# Altium schematic sheet Sheet1.SchDoc
size A1; SheetNumber: 1; SheetTotal: 1
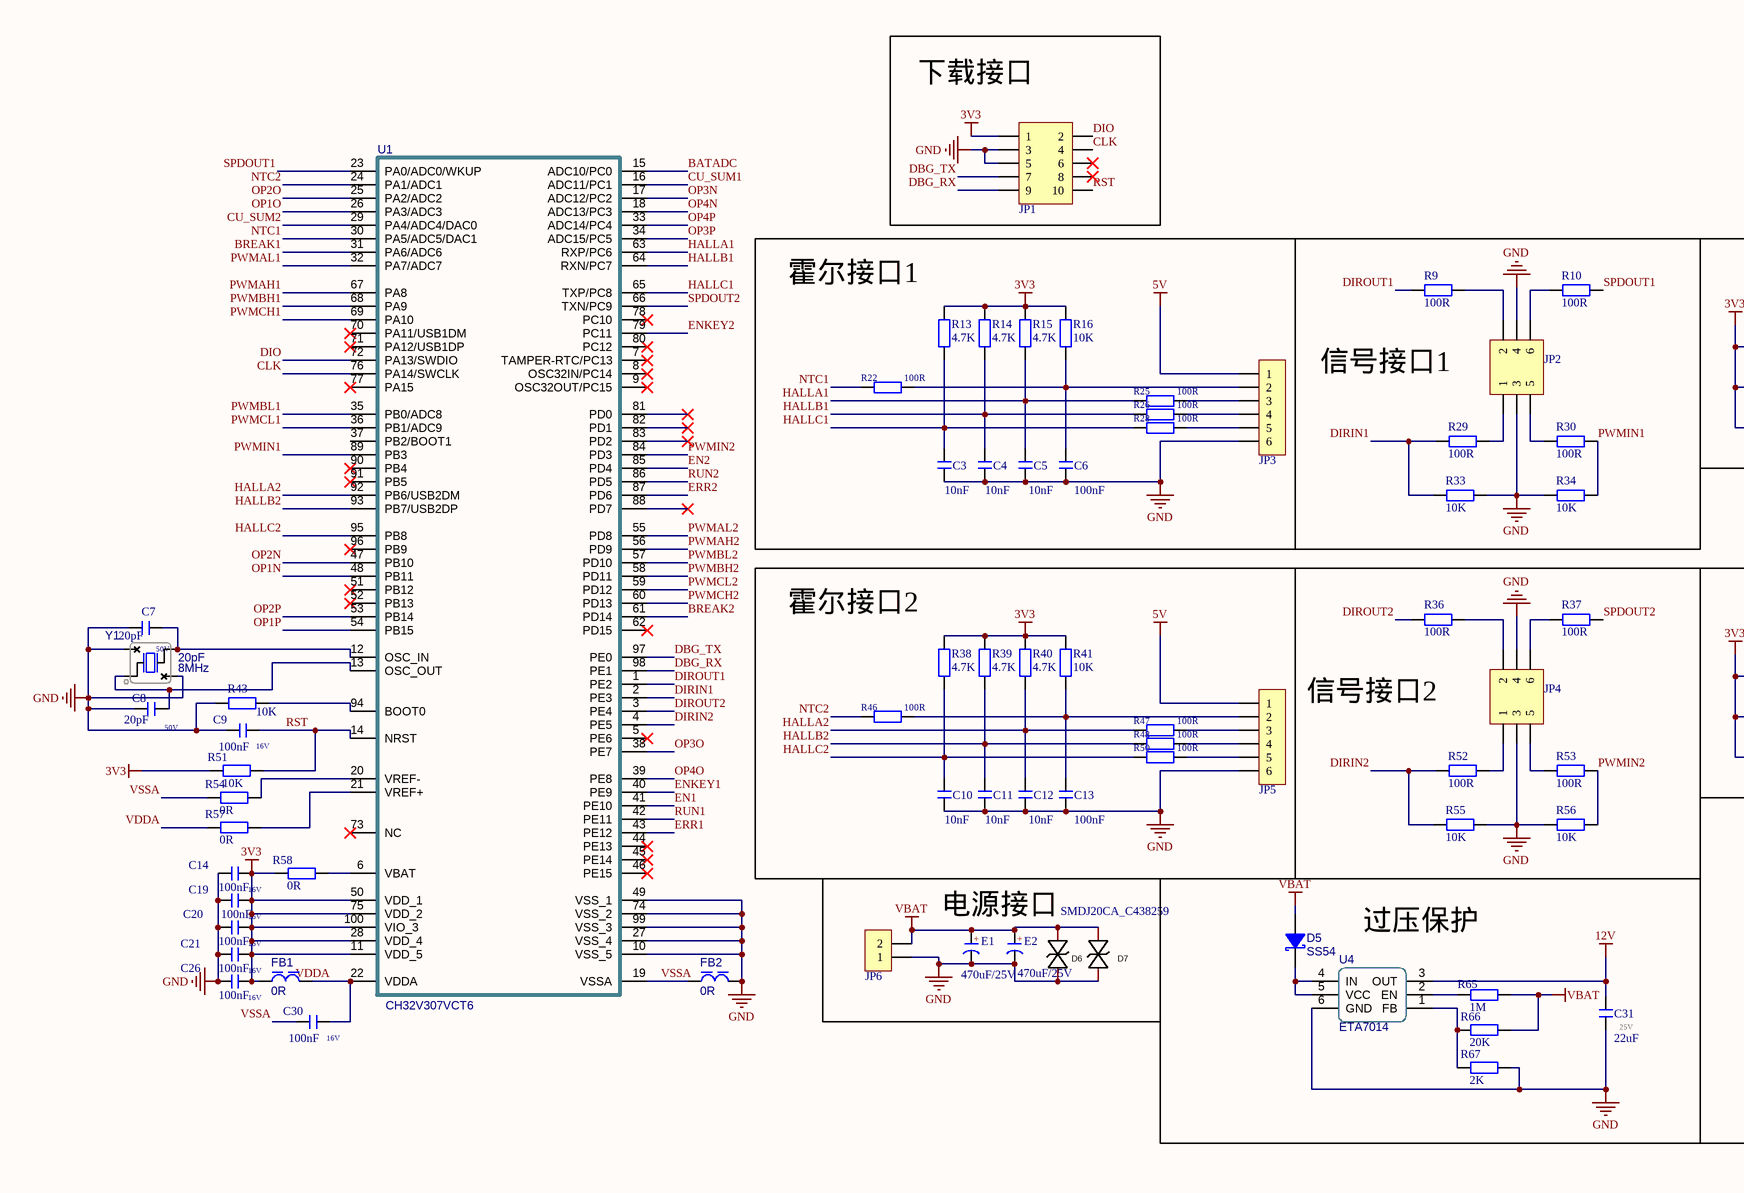
[diagram p0: Sheet1.SchDoc, top left]
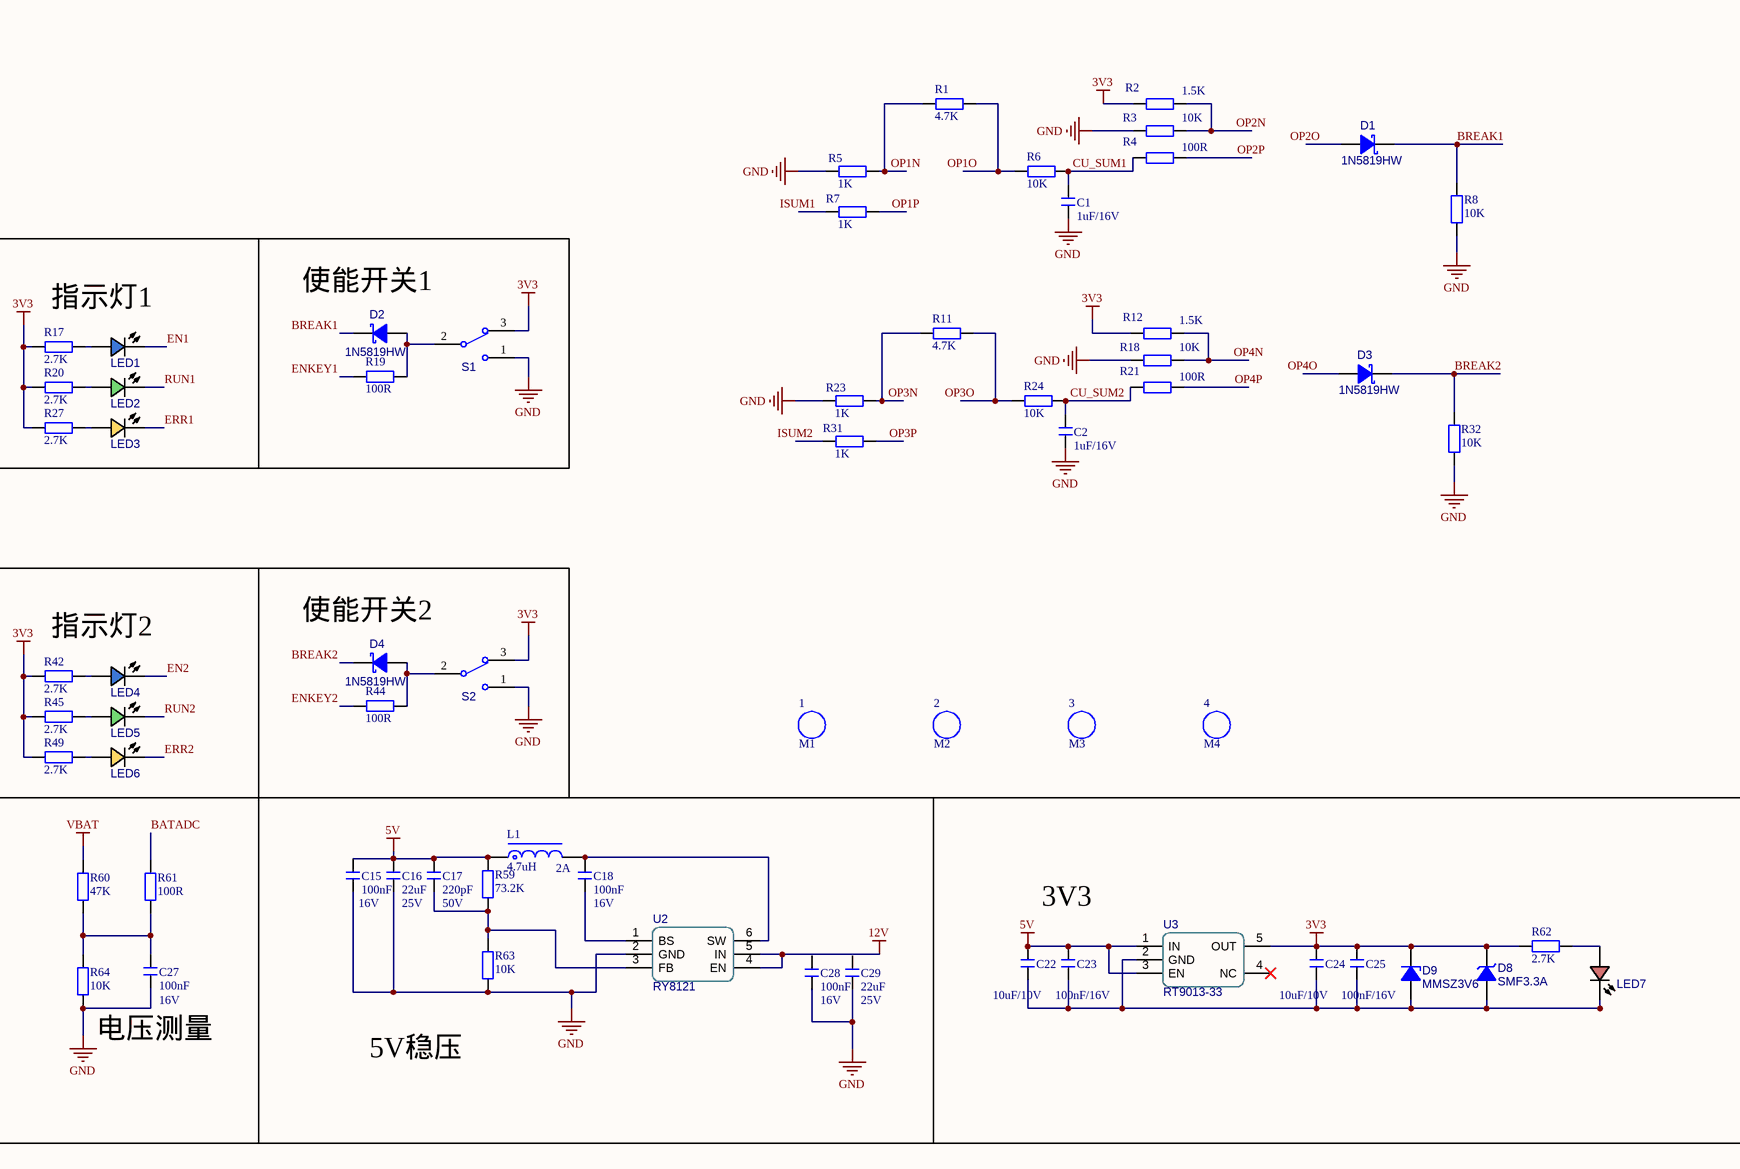
[diagram p1: Sheet1.SchDoc, top right]
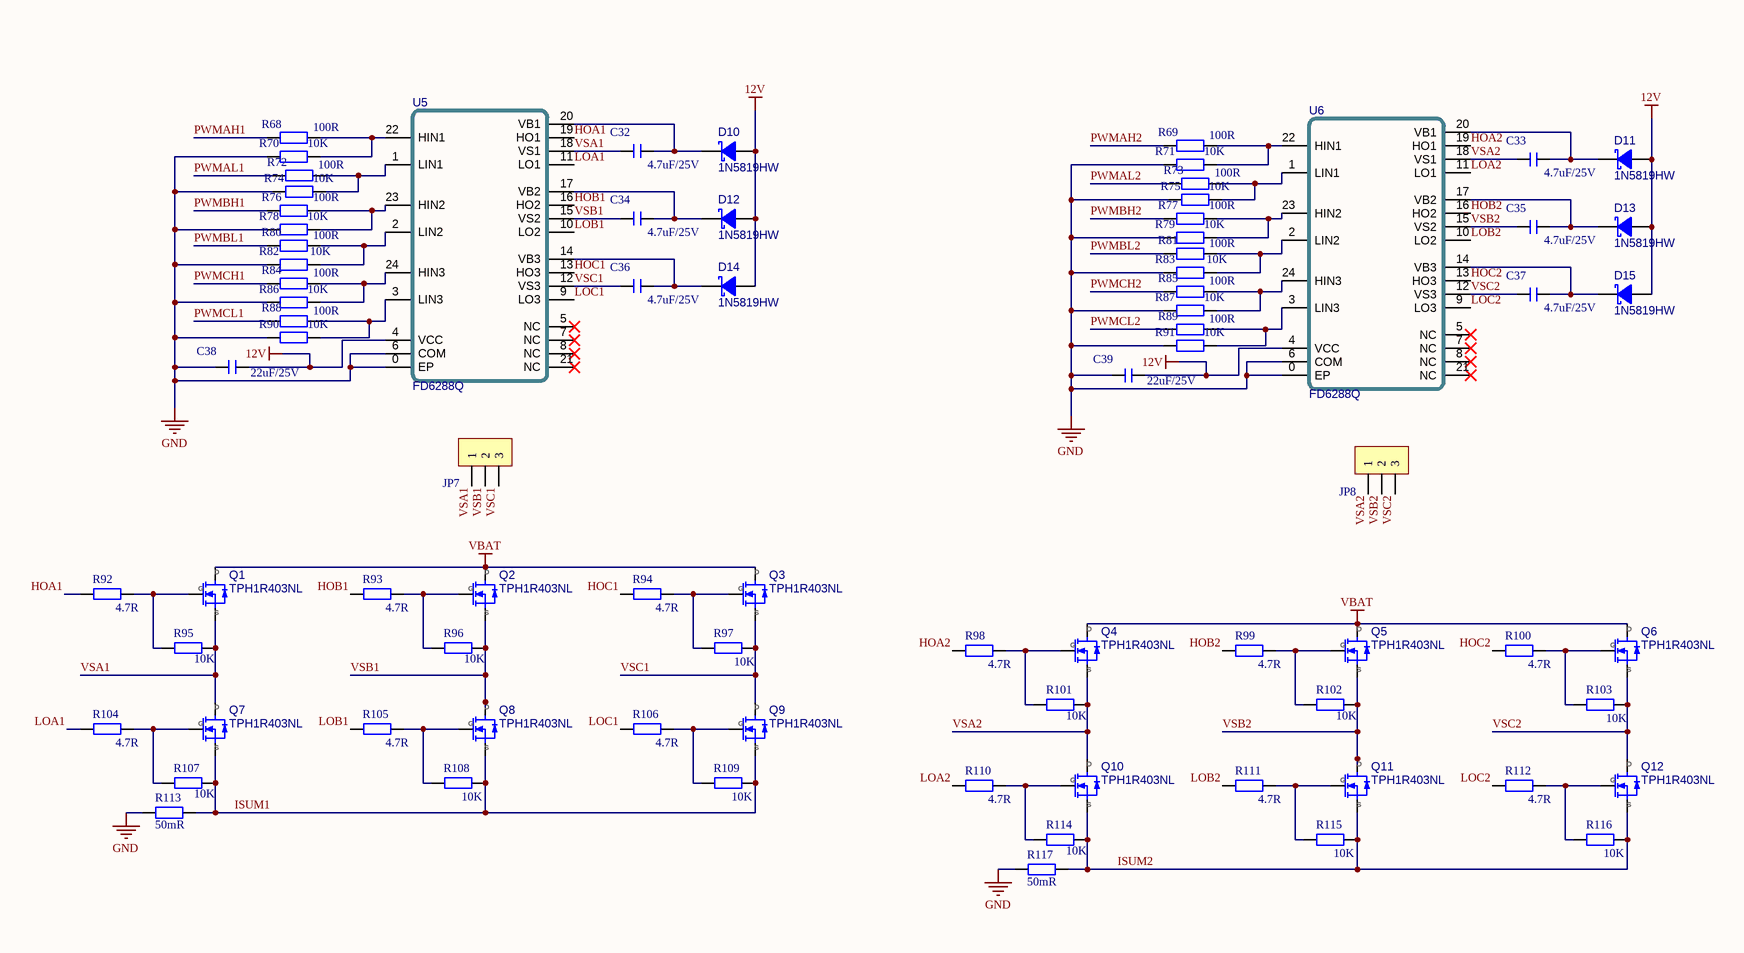
[diagram p2: Sheet1.SchDoc, bottom left]

## Parts
1  M1  [M3 125X200]
2  M2  [M3 125X200]
3  M3  [M3 125X200]
4  M4  [M3 125X200]
C1  1uF/16V  [C 0603_L]
C2  1uF/16V  [C 0603_L]
C3  10nF  [C 0402_L]
C4  10nF  [C 0402_L]
C5  10nF  [C 0402_L]
C6  100nF  [C 0402_L]
C7  20pF  电压: 50V  [C 0402_L]
C8  20pF  电压: 50V  [C 0402_L]
C9  100nF  电压: 16V  [C 0402_L]
C10  10nF  [C 0402_L]
C11  10nF  [C 0402_L]
C12  10nF  [C 0402_L]
C13  100nF  [C 0402_L]
C14  100nF  电压: 16V  [C 0402_L]
C15  100nF  V: 16V  [C 0402_L]
C16  22uF  V: 25V  [C 0805_L]
C17  220pF  V: 50V  [C 0402_L]
C18  100nF  V: 16V  [C 0402_L]
C19  100nF  电压: 16V  [C 0402_L]
C20  100nF  电压: 16V  [C 0402_L]
C21  100nF  电压: 16V  [C 0402_L]
C22  10uF/10V  [C 0603_L]
C23  100nF/16V  [C 0402_L]
C24  10uF/10V  [C 0603_L]
C25  100nF/16V  [C 0402_L]
C26  100nF  电压: 16V  [C 0402_L]
C27  100nF  V: 16V  [C 0402_L]
C28  100nF  V: 16V  [C 0402_L]
C29  22uF  V: 25V  [C 0805_L]
C30  100nF  电压: 16V  [C 0402_M]
C31  22uF  V: 25V  [C 0805_L]
C32  4.7uF/25V  [C 0805_L]
C33  4.7uF/25V  [C 0805_L]
C34  4.7uF/25V  [C 0805_L]
C35  4.7uF/25V  [C 0805_L]
C36  4.7uF/25V  [C 0805_L]
C37  4.7uF/25V  [C 0805_L]
C38  22uF/25V  [C 0805_L]
C39  22uF/25V  [C 0805_L]
D1  1N5819HW  [SOD-123-L]
D2  1N5819HW  [SOD-123-L]
D3  1N5819HW  [SOD-123-L]
D4  1N5819HW  [SOD-123-L]
D5  SS54  [SMA-L[DO-214AC]]
D6  SMDJ20CA_C438259  [SMC_L6.9-W5.9-LS7.9-BI]
D7  SMDJ20CA_C438259  [SMC_L6.9-W5.9-LS7.9-BI]  (value not drawn)
D8  SMF3.3A  [SOD-123-L]
D9  MMSZ3V6  [SOD-123-L]
D10  1N5819HW  [SOD-123-L]
D11  1N5819HW  [SOD-123-L]
D12  1N5819HW  [SOD-123-L]
D13  1N5819HW  [SOD-123-L]
D14  1N5819HW  [SOD-123-L]
D15  1N5819HW  [SOD-123-L]
E1  470uF/25V  [CAP 5.0*10*12.5]
E2  470uF/25V  [CAP 5.0*10*16]
FB1  value 0R  [INDC1005[0402]S]  (hidden comment: 0R @100MHz 500mA)
FB2  value 0R  [INDC1005[0402]S]  (hidden comment: 0R @100MHz 500mA)
JP1  Header 5X2  [HDR2.54-WI-2x5P]  (value not drawn)
JP2  Header3X2  [HDR2.54-LI-2x3P]  (value not drawn)
JP3  HDR-1X6  [ZH1.5-WI-6P]  (value not drawn)
JP4  Header3X2  [HDR2.54-LI-2x3P]  (value not drawn)
JP5  HDR-1X6  [ZH1.5-WI-6P]  (value not drawn)
JP6  HDR-1X2  [KF350-2P]  (value not drawn)
JP7  HDR-1X3  [KF350-3P]  (value not drawn)
JP8  HDR-1X3  [KF350-3P]  (value not drawn)
L1  4.7uH  A: 2A  [CD31]
LED1  蓝色贴片LED  [LEDC1608(0603)-L]  (value not drawn)
LED2  翠绿贴片LED  [LEDC1608(0603)-L]  (value not drawn)
LED3  黄色贴片LED  [LEDC1608(0603)-L]  (value not drawn)
LED4  蓝色贴片LED  [LEDC1608(0603)-L]  (value not drawn)
LED5  翠绿贴片LED  [LEDC1608(0603)-L]  (value not drawn)
LED6  黄色贴片LED  [LEDC1608(0603)-L]  (value not drawn)
LED7  红色贴片LED  [LEDC1608(0603)-L]  (value not drawn)
Q1  TPH1R403NL  [DFN5x6]
Q2  TPH1R403NL  [DFN5x6]
Q3  TPH1R403NL  [DFN5x6]
Q4  TPH1R403NL  [DFN5x6]
Q5  TPH1R403NL  [DFN5x6]
Q6  TPH1R403NL  [DFN5x6]
Q7  TPH1R403NL  [DFN5x6]
Q8  TPH1R403NL  [DFN5x6]
Q9  TPH1R403NL  [DFN5x6]
Q10  TPH1R403NL  [DFN5x6]
Q11  TPH1R403NL  [DFN5x6]
Q12  TPH1R403NL  [DFN5x6]
R1  4.7K  [R 0603_L]
R2  1.5K  [R 0603_L]
R3  10K  [R 0603_L]
R4  100R  [R 0603_L]
R5  1K  [R 0603_L]
R6  10K  [R 0603_L]
R7  1K  [R 0603_L]
R8  10K  [R 0603_L]
R9  100R  [R 0603_L]
R10  100R  [R 0603_L]
R11  4.7K  [R 0603_L]
R12  1.5K  [R 0603_L]
R13  4.7K  [R 0603_L]
R14  4.7K  [R 0603_L]
R15  4.7K  [R 0603_L]
R16  10K  [R 0603_L]
R17  2.7K  [R 0603_L]
R18  10K  [R 0603_L]
R19  100R  [R 0603_L]
R20  2.7K  [R 0603_L]
R21  100R  [R 0603_L]
R22  100R  [R 0603_L]
R23  1K  [R 0603_L]
R24  10K  [R 0603_L]
R25  100R  [R 0603_L]
R26  100R  [R 0603_L]
R27  2.7K  [R 0603_L]
R28  100R  [R 0603_L]
R29  100R  [R 0603_L]
R30  100R  [R 0603_L]
R31  1K  [R 0603_L]
R32  10K  [R 0603_L]
R33  10K  [R 0603_L]
R34  10K  [R 0603_L]
R36  100R  [R 0603_L]
R37  100R  [R 0603_L]
R38  4.7K  [R 0603_L]
R39  4.7K  [R 0603_L]
R40  4.7K  [R 0603_L]
R41  10K  [R 0603_L]
R42  2.7K  [R 0603_L]
R43  10K  [R 0805_L]
R44  100R  [R 0603_L]
R45  2.7K  [R 0603_L]
R46  100R  [R 0603_L]
R47  100R  [R 0603_L]
R48  100R  [R 0603_L]
R49  2.7K  [R 0603_L]
R50  100R  [R 0603_L]
R51  10K  [R 0603_L]
R52  100R  [R 0603_L]
R53  100R  [R 0603_L]
R54  0R  [R 0603_L]
R55  10K  [R 0603_L]
R56  10K  [R 0603_L]
R57  0R  [R 0603_L]
R58  0R  [R 0402_L]
R59  73.2K  [R 0603_L]
R60  47K  [R 0603_L]
R61  100R  [R 0603_L]
R62  2.7K  [R 0603_L]
R63  10K  [R 0603_L]
R64  10K  [R 0603_L]
R65  1M  [R 0603_L]
R66  20K  [R 0603_L]
R67  2K  [R 0603_L]
R68  100R  [R 0603_L]
R69  100R  [R 0603_L]
R70  10K  [R 0603_L]
R71  10K  [R 0603_L]
R72  100R  [R 0603_L]
R73  100R  [R 0603_L]
R74  10K  [R 0603_L]
R75  10K  [R 0603_L]
R76  100R  [R 0603_L]
R77  100R  [R 0603_L]
R78  10K  [R 0603_L]
R79  10K  [R 0603_L]
R80  100R  [R 0603_L]
R81  100R  [R 0603_L]
R82  10K  [R 0603_L]
R83  10K  [R 0603_L]
R84  100R  [R 0603_L]
R85  100R  [R 0603_L]
R86  10K  [R 0603_L]
R87  10K  [R 0603_L]
R88  100R  [R 0603_L]
R89  100R  [R 0603_L]
R90  10K  [R 0603_L]
R91  10K  [R 0603_L]
R92  4.7R  [R 0603_L]
R93  4.7R  [R 0603_L]
R94  4.7R  [R 0603_L]
R95  10K  [R 0603_L]
R96  10K  [R 0603_L]
R97  10K  [R 0603_L]
R98  4.7R  [R 0603_L]
R99  4.7R  [R 0603_L]
R100  4.7R  [R 0603_L]
R101  10K  [R 0603_L]
R102  10K  [R 0603_L]
R103  10K  [R 0603_L]
R104  4.7R  [R 0603_L]
R105  4.7R  [R 0603_L]
R106  4.7R  [R 0603_L]
R107  10K  [R 0603_L]
R108  10K  [R 0603_L]
R109  10K  [R 0603_L]
R110  4.7R  [R 0603_L]
R111  4.7R  [R 0603_L]
R112  4.7R  [R 0603_L]
R113  50mR  [R 1206_M]
R114  10K  [R 0603_L]
R115  10K  [R 0603_L]
R116  10K  [R 0603_L]
R117  50mR  [R 1206_M]
S1  SW-SPDT  [SS12D10]  (value not drawn)
S2  SW-SPDT  [SS12D10]  (value not drawn)
U1  CH32V307VCT6  [LQFP100_N]
U2  RY8121  [SOT-23-6]
U3  RT9013-33  [SOT-23-5]
U4  ETA7014  [SOT-23-6]
U5  FD6288Q  [QFN24-4x4]
U6  FD6288Q  [QFN24-4x4]
Y1  Load Capactiance: 20pF  [X3225-4]  (hidden comment: 8MHz)

## Blocks framed on the sheet
下载接口: JP1
霍尔接口1: C3-C6 JP3 R13-R16 R22 R25 R26 R28
霍尔接口2: C10-C13 JP5 R38-R41 R46-R48 R50

## Nets
3V3: C14.2 C19.2 C20.2 C21.2 C24.2 C25.2 C26.2 D8.K D9.K FB1.1 JP1.1 R2.1 R12.1 R13.2 R14.2 R15.2 R16.2 R17.1 R20.1 R27.1 R38.2 R39.2 R40.2 R41.2 R42.1 R45.1 R49.1 R51.1 R58.1 R62.1 S1.3 S2.3 U1.11(VDD_5) U1.28(VDD_4) U1.50(VDD_1) U1.75(VDD_2) U1.100(VIO_3) U3.5(OUT)
5V: C15.2 C16.2 C17.2 C22.2 C23.2 JP3.1 JP5.1 L1.1 R59.2 U3.1(IN) U3.3(EN)
12V: C31.2 C38.2 C39.2 D10.A D11.A D12.A D13.A D14.A D15.A U2.4(EN) U2.5(IN) U4.3(OUT) U5.4(VCC) U6.4(VCC)
GND: C1.1 C2.1 C3.2 C4.2 C5.2 C6.1 C7.1 C8.1 C9.1 C10.2 C11.2 C12.2 C13.1 C14.1 C15.1 C16.1 C19.1 C20.1 C21.1 C26.1 C27.1 C28.1 C29.1 C31.1 C38.1 C39.1 D6.2 D7.2 E1.2(K) E2.2(K) FB2.2 JP1.3 JP1.5 JP2.3 JP2.4 JP3.6 JP4.3 JP4.4 JP5.6 JP6.1 R3.1 R5.1 R8.2 R18.1 R23.1 R32.2 R33.2 R34.1 R43.1 R55.2 R56.1 R63.1 R64.1 R67.2 R70.1 R71.1 R74.1 R75.1 R78.1 R79.1 R82.1 R83.1 R86.1 R87.1 R90.1 R91.1 R113.1 R117.1 S1.1 S2.1 U1.10(VSS_5) U1.27(VSS_4) U1.49(VSS_1) U1.74(VSS_2) U1.99(VSS_3) U2.2(GND) U4.6(GND) U5.0(EP) U5.6(COM) U6.0(EP) U6.6(COM) Y1.2(NC) Y1.4(NC)
VBAT: D5.A D6.1 D7.1 E1.1(A) E2.1(A) JP6.2 Q1.1(D) Q2.1(D) Q3.1(D) Q4.1(D) Q5.1(D) Q6.1(D) R60.2 R65.2 R66.2
BATADC: R61.2 U1.15(ADC10/PC0)
BREAK1: D1.K D2.K R8.1 U1.31(PA6/ADC6)
BREAK2: D3.K D4.K R32.1 U1.61(PD14)
CLK: JP1.4 U1.76(PA14/SWCLK)
CU_SUM1: C1.2 R4.1 R6.2 U1.16(ADC11/PC1)
CU_SUM2: C2.2 R21.1 R24.2 U1.29(PA4/ADC4/DAC0)
DBG_RX: JP1.9 U1.98(PE1)
DBG_TX: JP1.7 U1.97(PE0)
DIO: JP1.2 U1.72(PA13/SWDIO)
DIRIN1: R29.1 R33.1 U1.2(PE3)
DIRIN2: R52.1 R55.1 U1.4(PE5)
DIROUT1: R9.1 U1.1(PE2)
DIROUT2: R36.1 U1.3(PE4)
EN1: LED1.C U1.41(PE10)
EN2: LED4.C U1.85(PD4)
ENKEY1: R19.1 U1.40(PE9)
ENKEY2: R44.1 U1.79(PC11)
ERR1: LED3.C U1.43(PE12)
ERR2: LED6.C U1.87(PD6)
HALLA1: C5.1 R15.1 R25.1 U1.63(RXP/PC6)
HALLA2: C12.1 R40.1 R47.1 U1.92(PB6/USB2DM)
HALLB1: C4.1 R14.1 R26.1 U1.64(RXN/PC7)
HALLB2: C11.1 R39.1 R48.1 U1.93(PB7/USB2DP)
HALLC1: C3.1 R13.1 R28.1 U1.65(TXP/PC8)
HALLC2: C10.1 R38.1 R50.1 U1.95(PB8)
HOA1: R92.1 U5.19(HO1)
HOA2: R98.1 U6.19(HO1)
HOB1: R93.1 U5.16(HO2)
HOB2: R99.1 U6.16(HO2)
HOC1: R94.1 U5.13(HO3)
HOC2: R100.1 U6.13(HO3)
ISUM1: Q7.3(S) Q8.3(S) Q9.3(S) R7.1 R107.2 R108.2 R109.2 R113.2
ISUM2: Q10.3(S) Q11.3(S) Q12.3(S) R31.1 R114.2 R115.2 R116.2 R117.2
LOA1: R104.1 U5.11(LO1)
LOA2: R110.1 U6.11(LO1)
LOB1: R105.1 U5.10(LO2)
LOB2: R111.1 U6.10(LO2)
LOC1: R106.1 U5.9(LO3)
LOC2: R112.1 U6.9(LO3)
NTC1: R22.1 U1.30(PA5/ADC5/DAC1)
NTC2: R46.1 U1.24(PA1/ADC1)
OP1N: R1.1 R5.2 U1.48(PB11)
OP1O: R1.2 R6.1 U1.26(PA3/ADC3)
OP1P: R7.2 U1.54(PB15)
OP2N: R2.2 R3.2 U1.47(PB10)
OP2O: D1.A U1.25(PA2/ADC2)
OP2P: R4.2 U1.53(PB14)
OP3N: R11.1 R23.2 U1.17(ADC12/PC2)
OP3O: R11.2 R24.1 U1.38(PE7)
OP3P: R31.2 U1.34(ADC15/PC5)
OP4N: R12.2 R18.2 U1.18(ADC13/PC3)
OP4O: D3.A U1.39(PE8)
OP4P: R21.2 U1.33(ADC14/PC4)
PWMAH1: R68.1 U1.67(PA8)
PWMAH2: R69.1 U1.56(PD9)
PWMAL1: R72.1 U1.32(PA7/ADC7)
PWMAL2: R73.1 U1.55(PD8)
PWMBH1: R76.1 U1.68(PA9)
PWMBH2: R77.1 U1.58(PD11)
PWMBL1: R80.1 U1.35(PB0/ADC8)
PWMBL2: R81.1 U1.57(PD10)
PWMCH1: R84.1 U1.69(PA10)
PWMCH2: R85.1 U1.60(PD13)
PWMCL1: R88.1 U1.36(PB1/ADC9)
PWMCL2: R89.1 U1.59(PD12)
PWMIN1: R30.2 R34.2 U1.89(PB3)
PWMIN2: R53.2 R56.2 U1.84(PD3)
RST: C9.2 JP1.10 R51.2 U1.14(NRST)
RUN1: LED2.C U1.42(PE11)
RUN2: LED5.C U1.86(PD5)
SPDOUT1: R10.2 U1.23(PA0/ADC0/WKUP)
SPDOUT2: R37.2 U1.66(TXN/PC9)
VDDA: C30.2 FB1.2 R57.1 U1.22(VDDA)
VSA1: C32.1 JP7.1 Q1.3(S) Q7.1(D) R95.2 U5.18(VS1)
VSA2: C33.1 JP8.1 Q4.3(S) Q10.1(D) R101.2 U6.18(VS1)
VSB1: C34.1 JP7.2 Q2.3(S) Q8.1(D) R96.2 U5.15(VS2)
VSB2: C35.1 JP8.2 Q5.3(S) Q11.1(D) R102.2 U6.15(VS2)
VSC1: C36.1 JP7.3 Q3.3(S) Q9.1(D) R97.2 U5.12(VS3)
VSC2: C37.1 JP8.3 Q6.3(S) Q12.1(D) R103.2 U6.12(VS3)
VSSA: C30.1 FB2.1 R54.1 U1.19(VSSA)
NetC6_2: C6.2 JP3.2 R16.1 R22.2
NetC7_2: C7.2 U1.12(OSC_IN) Y1.3(OSC2)
NetC8_2: C8.2 U1.13(OSC_OUT) Y1.1(OSC1)
NetC13_2: C13.2 JP5.2 R41.1 R46.2
NetC17_1: C17.1 R59.1 R63.2 U2.3(FB)
NetC18_1: C18.1 U2.1(BS)
NetC18_2: C18.2 L1.2 U2.6(SW)
NetC22_1: C22.1 C23.1 C24.1 C25.1 D8.A D9.A LED7.C U3.2(GND)
NetC27_2: C27.2 R60.1 R61.1 R64.2
NetC32_2: C32.2 D10.K U5.20(VB1)
NetC33_2: C33.2 D11.K U6.20(VB1)
NetC34_2: C34.2 D12.K U5.17(VB2)
NetC35_2: C35.2 D13.K U6.17(VB2)
NetC36_2: C36.2 D14.K U5.14(VB3)
NetC37_2: C37.2 D15.K U6.14(VB3)
NetD2_A: D2.A R19.2 S1.2
NetD4_A: D4.A R44.2 S2.2
NetD5_K: D5.K U4.4(IN) U4.5(VCC)
NetJP2_1: JP2.1 R29.2
NetJP2_2: JP2.2 R9.2
NetJP2_5: JP2.5 R30.1
NetJP2_6: JP2.6 R10.1
NetJP3_3: JP3.3 R25.2
NetJP3_4: JP3.4 R26.2
NetJP3_5: JP3.5 R28.2
NetJP4_1: JP4.1 R52.2
NetJP4_2: JP4.2 R36.2
NetJP4_5: JP4.5 R53.1
NetJP4_6: JP4.6 R37.1
NetJP5_3: JP5.3 R47.2
NetJP5_4: JP5.4 R48.2
NetJP5_5: JP5.5 R50.2
NetLED1_A: LED1.A R17.2
NetLED2_A: LED2.A R20.2
NetLED3_A: LED3.A R27.2
NetLED4_A: LED4.A R42.2
NetLED5_A: LED5.A R45.2
NetLED6_A: LED6.A R49.2
NetLED7_A: LED7.A R62.2
NetQ1_2: Q1.2(G) R92.2 R95.1
NetQ2_2: Q2.2(G) R93.2 R96.1
NetQ3_2: Q3.2(G) R94.2 R97.1
NetQ4_2: Q4.2(G) R98.2 R101.1
NetQ5_2: Q5.2(G) R99.2 R102.1
NetQ6_2: Q6.2(G) R100.2 R103.1
NetQ7_2: Q7.2(G) R104.2 R107.1
NetQ8_2: Q8.2(G) R105.2 R108.1
NetQ9_2: Q9.2(G) R106.2 R109.1
NetQ10_2: Q10.2(G) R110.2 R114.1
NetQ11_2: Q11.2(G) R111.2 R115.1
NetQ12_2: Q12.2(G) R112.2 R116.1
NetR43_2: R43.2 U1.94(BOOT0)
NetR54_2: R54.2 U1.20(VREF-)
NetR57_2: R57.2 U1.21(VREF+)
NetR58_2: R58.2 U1.6(VBAT)
NetR65_1: R65.1 U4.2(EN)
NetR66_1: R66.1 R67.1 U4.1(FB)
NetR68_2: R68.2 R70.2 U5.22(HIN1)
NetR69_2: R69.2 R71.2 U6.22(HIN1)
NetR72_2: R72.2 R74.2 U5.1(LIN1)
NetR73_2: R73.2 R75.2 U6.1(LIN1)
NetR76_2: R76.2 R78.2 U5.23(HIN2)
NetR77_2: R77.2 R79.2 U6.23(HIN2)
NetR80_2: R80.2 R82.2 U5.2(LIN2)
NetR81_2: R81.2 R83.2 U6.2(LIN2)
NetR84_2: R84.2 R86.2 U5.24(HIN3)
NetR85_2: R85.2 R87.2 U6.24(HIN3)
NetR88_2: R88.2 R90.2 U5.3(LIN3)
NetR89_2: R89.2 R91.2 U6.3(LIN3)

Not connected (* = marked no-connect by the designer): C28 2; C29 2; JP1 6* 8*; U1 5(PE6)* 7(TAMPER-RTC/PC13)* 8(OSC32IN/PC14)* 9(OSC32OUT/PC15)* 37(PB2/BOOT1) 44(PE13)* 45(PE14)* 46(PE15)* 51(PB12)* 52(PB13)* 62(PD15)* 70(PA11/USB1DM)* 71(PA12/USB1DP)* 73(NC)* 77(PA15)* 78(PC10)* 80(PC12)* 81(PD0)* 82(PD1)* 83(PD2)* 88(PD7)* 90(PB4)* 91(PB5)* 96(PB9)*; U3 4(NC)*; U5 5(NC)* 7(NC)* 8(NC)* 21(NC)*; U6 5(NC)* 7(NC)* 8(NC)* 21(NC)*

## Notes on the sheet
- 指示灯1
- (near D2) 使能开关1
- 信号接口1
- 指示灯2
- (near D4) 使能开关2
- 信号接口2
- 电源接口
- 过压保护
- 3V3
- (near R64) 电压测量
- 5V稳压
- (in symbol C-CAP) +

## Library data of the parts
1-4 = M3: 铜柱孔; 版权归属: 源创客; BOM名称: 铜柱孔; 学习资源: www.ooocke.com
C1-C39 = C: 无极性贴片电容; 版权归属: 源创客; BOM名称: 无极性贴片电容; 学习资源: www.ooocke.com
D1-D4 D10-D15 = 1N5819HW: 1N5819HW 肖特基二极管; Revision: V1.0; Value: 1N5819HW
D5 = SS54: SS54 肖特基二极管; Revision: V1.0; Value: SS54
D6 D7 = SMDJ20CA_C438259: Designer: U?; Symbol: SMDJ20CA_C438259; Device: SMDJ20CA_C438259
D8 = Diode TVS Uni-Dir: TRANSIENT VOLTAGE  SUPPRESSOR DIODE; Imax: 500mA; Published: 8-Jun-2000; Publisher: Altium Limited; Price(RMB): 0.000
D9 = Diode Zen: 稳压二极管 齐纳二极管  Zener Diode; Published: 8-Jun-2000; Revision: July-2002: Re-released for DXP Platform.; Publisher: Altium Limited; Price(RMB): 0.000
E1 E2 = C-CAP: 直插电解电容; 版权归属: 源创客; BOM名称: 直插电解电容; 学习资源: www.ooocke.com
FB1 FB2 = FB-Chip: 贴片磁珠; DCR: .1m; Published: 2020-12-18; Revision: V1.0; Frequency: @100MHz; Imax: 500mA
JP1 = Header 5X2: 5*2P接插件; 版权归属: 源创客; BOM名称: 5*2P接插件; 学习资源: www.ooocke.com
JP2 JP4 = Header 3X2: 3*2P接插件; 版权归属: 源创客; BOM名称: 3*2P接插件; 学习资源: www.ooocke.com
JP3 JP5 = Header 6: 6P接插件; 版权归属: 源创客; BOM名称: 6P接插件; 学习资源: www.ooocke.com
JP6 = Header 2: 2P接插件; 版权归属: 源创客; BOM名称: 2P接插件; 学习资源: www.ooocke.com
JP7 JP8 = Header 3: 3P接插件; 版权归属: 源创客; BOM名称: 3P接插件; 学习资源: www.ooocke.com
L1 = L-CD: 贴片功率电感; BOM名称: 功率电感; 版权归属: 源创客; 学习资源: www.ooocke.com
LED1 LED4 = LED Chip Blue: Color: Blue; Published: 8-Jun-2000; Revision: July-2002: Re-released for DXP Platform.; Publisher: Altium Limited; Price(RMB): 0.00
LED2 LED5 = LED Chip Green: Published: 8-Jun-2000; Revision: July-2002: Re-released for DXP Platform.; Publisher: Altium Limited; Price(RMB): 0.00
LED3 LED6 = LED Chip Yellow: Published: 8-Jun-2000; Revision: July-2002: Re-released for DXP Platform.; Publisher: Altium Limited; Price(RMB): 0.00
LED7 = LED Chip Red: Published: 8-Jun-2000; Revision: July-2002: Re-released for DXP Platform.; Publisher: Altium Limited; Price(RMB): 0.00
Q1-Q12 = TPH1R403NL: 东芝 N沟 MOS
R1-R34 R36-R117 = R: 贴片电阻; 版权归属: 源创客; BOM名称: 贴片电阻; 学习资源: www.ooocke.com
S1 S2 = SW-SPDT: 单刀双掷开关 3脚船型、钮子、拨动开关 SPDT Subminiature Toggle Switch; Published: 24-Mar-1999; Publisher: Altium Limited; Price(RMB): 0.000
U1 = CH32V307VCT6: CH32V307VCT6 沁恒32位RISCV单片机; Published: 30-May-2008; DatasheetVersion: rev6, Mar-2008; PackageVersion: Mar-2008; PackageReference: LQFP100; Publisher: Altium Limited; PackageDescription: 100-Pin Low-Profile Quad Flat Pack, 14 x 14 mm Body, 0.5 mm Pitch (LQFP100); ComponentLink1Description: Manufacturer Link; ComponentLink1URL: www.st.com/stm32; ComponentLink2Description: Datasheet; ComponentLink2URL: http://www.st.com/stonline/products/literature/ds/13587.pdf
U2 = RY8121: 18V 2A 1MHz Synchronous Step-Down Regulator
U3 = RT9013-33: 3.3V 500mA SOT-23-5 LDO
U4 = ETA7014: ETA7014 OVP芯片
U5 U6 = FD6288Q: FD6288Q 三相栅极驱动器
Y1 = XTAL-4: 四脚无源晶振 Crystal Oscillator; Published: 8-Jun-2000; Revision: July-2002: Re-released for DXP Platform.; Publisher: Altium Limited; Frequency: 8MHz